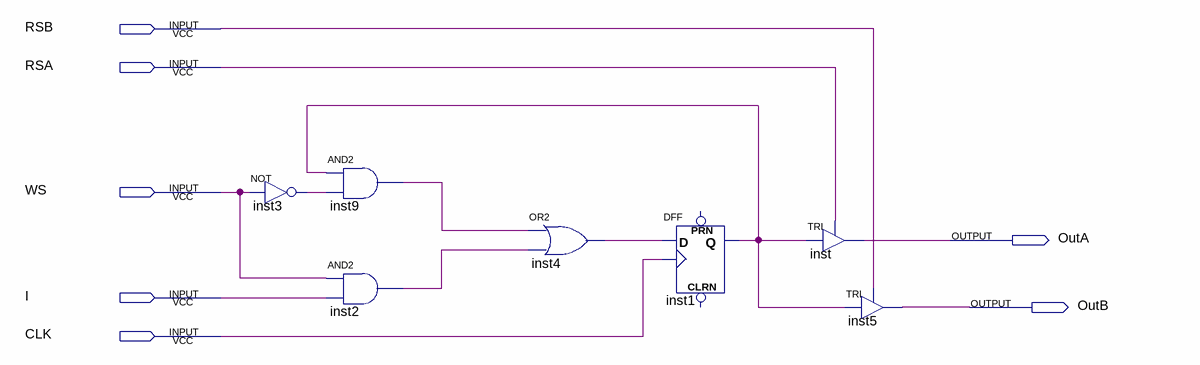
[diagram p0: schematic sheet]
// Quartus schematic RFC.bdf as structural Verilog: 7 symbols, 7 pins
module RFC (
  input  RSB,
  input  RSA,
  input  WS,
  input  I,
  input  CLK,
  output OutA,
  output OutB
);

  wire inst1_q, inst2_out, inst3_out, inst4_out, inst9_out;

  not inst3 (inst3_out, WS);
  and inst9 (inst9_out, inst1_q, inst3_out);
  and inst2 (inst2_out, WS, I);
  or inst4 (inst4_out, inst9_out, inst2_out);
  DFF inst1 (.CLK(CLK), .D(inst4_out), .Q(inst1_q));  // open: CLRN, PRN
  TRI inst (.IN(inst1_q), .OE(RSA), .OUT(OutA));
  TRI inst5 (.IN(inst1_q), .OE(RSB), .OUT(OutB));
endmodule
